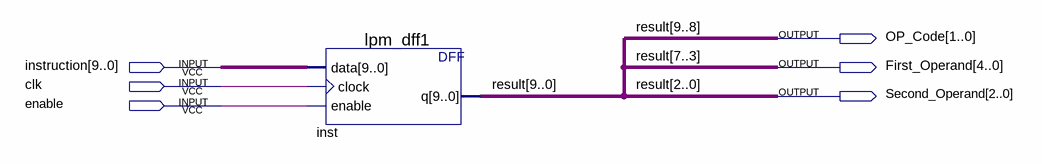
[diagram p0: schematic sheet]
// Quartus schematic InstructionDecoder.bdf as structural Verilog: 1 symbols, 6 pins
module InstructionDecoder (
  input  [9:0] instruction,
  input  clk,
  input  enable,
  output [1:0] OP_Code,
  output [4:0] First_Operand,
  output [2:0] Second_Operand
);

  lpm_dff1 inst (.data(instruction), .clock(clk), .enable(enable), .q({OP_Code, First_Operand, Second_Operand}));

  // Other names for the same wires on the sheet: result[9:0] = {OP_Code, First_Operand, Second_Operand}
endmodule
